# Altium schematic sheet STIM300-carrierboard.SchDoc
size A3; CompanyName: VORTEX NTNU
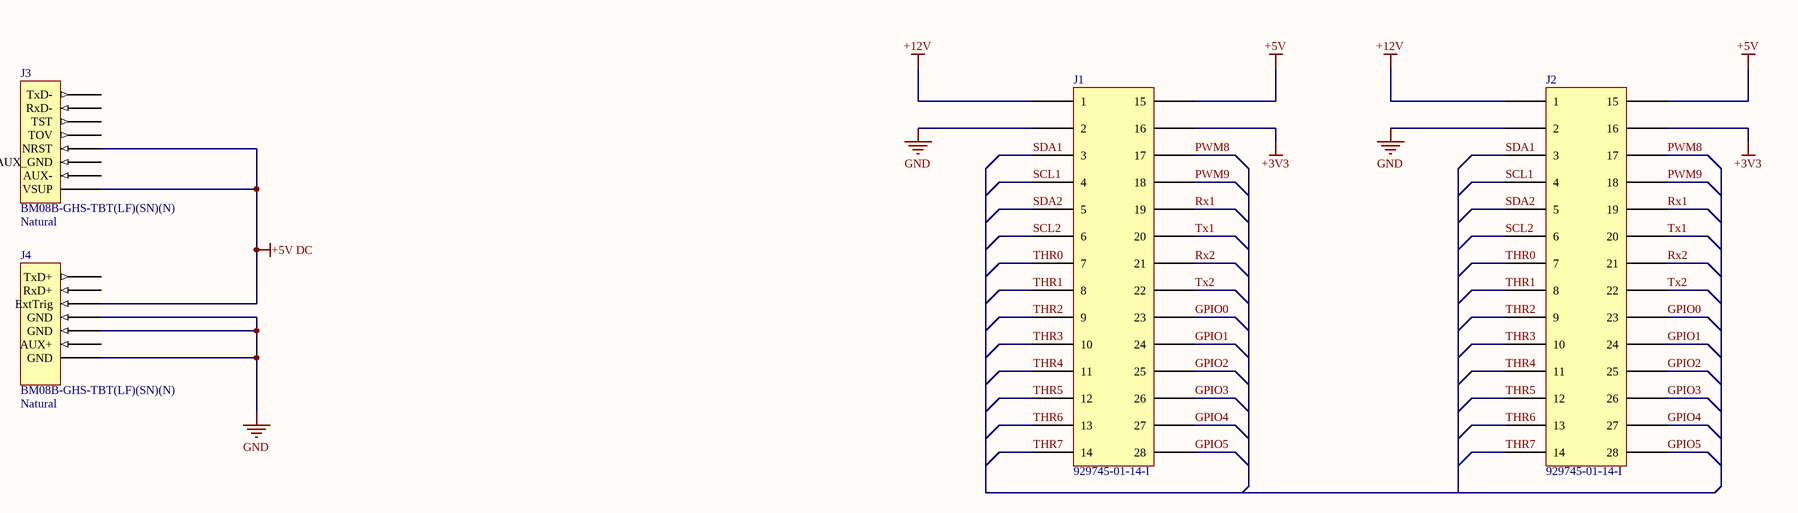
[diagram p0: STIM300-carrierboard.SchDoc]

## Parts
J1  929745-01-14-I  [Header_14x2_RA]
J2  929745-01-14-I  [Header_14x2_RA]
J3  BM08B-GHS-TBT(LF)(SN)(N)  Colour: Natural  [JST BM08B-GHS-TBT]
J4  BM08B-GHS-TBT(LF)(SN)(N)  Colour: Natural  [JST BM08B-GHS-TBT]

## Nets
+3V3: J1.16 J2.16
+5V: J1.15 J2.15
+5V DC: J3.5(NRST) J3.8(VSUP) J4.3(ExtTrig)
+12V: J1.1 J2.1
GND: J1.2 J2.2 J4.4(GND) J4.5(GND) J4.7(GND)
GPIO0: J1.23 J2.23
GPIO1: J1.24 J2.24
GPIO2: J1.25 J2.25
GPIO3: J1.26 J2.26
GPIO4: J1.27 J2.27
GPIO5: J1.28 J2.28
PWM8: J1.17 J2.17
PWM9: J1.18 J2.18
Rx1: J1.19 J2.19
Rx2: J1.21 J2.21
SCL1: J1.4 J2.4
SCL2: J1.6 J2.6
SDA1: J1.3 J2.3
SDA2: J1.5 J2.5
THR0: J1.7 J2.7
THR1: J1.8 J2.8
THR2: J1.9 J2.9
THR3: J1.10 J2.10
THR4: J1.11 J2.11
THR5: J1.12 J2.12
THR6: J1.13 J2.13
THR7: J1.14 J2.14
Tx1: J1.20 J2.20
Tx2: J1.22 J2.22

Not connected (* = marked no-connect by the designer): J3 1(TxD-) 2(RxD-) 3(TST) 4(TOV) 6(AUX_GND) 7(AUX-); J4 1(TxD+) 2(RxD+) 6(AUX+) 8(None)

## Notes on the sheet
- Title
- Size
- Author
- Rev
- A3
- Sheet no.
- of

## Library data of the parts
J1 J2 = 929745-01-14-I: Number Of Positions: 28; Part Number: 929745-01-14-I; ComponentLink1Description: Manufacturer Link; ComponentLink1URL: https://www.3m.com/3M/en_US/interconnect-us/; ComponentLink2Description: Datasheet; ComponentLink2URL: http://multimedia.3m.com/mws/media/43897O/3mtmpinstriphdr-100-100x-100-929-series-ts0769.pdf; Supplier 1: Digi-Key; Supplier Part Number 1: 3M156384-28-ND; Number Of Rows: 2; Mounting Type: Through Hole
J3 J4 = BM08B-GHS-TBT(LF)(SN)(N): CONN HEADER GH TOP 8POS 1.25MM; Manufacturer: JST Sales America Inc.; Pitch: 0.049" (1.25mm); Number Of Positions: 8; Part Number: BM08B-GHS-TBT(LF)(SN)(N); PartId: 7829; Supplier 1: Digi-Key; Supplier Part Number 1: 455-1584-2-ND; ComponentLink1Description: Datasheet; ComponentLink1URL: http://www.jst-mfg.com/product/pdf/eng/eGH.pdf; ComponentLink2Description: Digi-Key Listing; ComponentLink2URL: http://www.digikey.ca/product-detail/en/BM08B-GHS-TBT(LF)(SN)(N)/455-1584-2-ND/807806; Price: 0,3408; Type: Surface Mount; Contact Finish: Tin; Fastening Type: Locking Ramp; Number Of Rows: 1; Series: GH